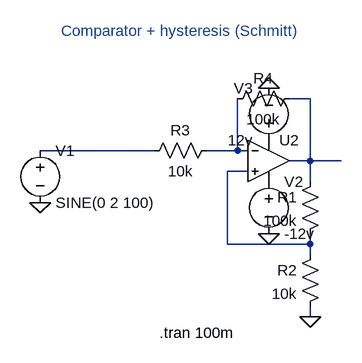
[diagram p0: schematic Comparator + hysteresis (Schmitt).asc]
Comparator + hysteresis (Schmitt).asc, the LTspice schematic file:
Version 4.1
SHEET 1 880 680
WIRE 272 48 240 48
WIRE 32 128 -144 128
WIRE 160 128 160 48
WIRE 160 128 112 128
WIRE 176 128 160 128
WIRE 272 144 272 48
WIRE 272 144 240 144
WIRE 320 144 272 144
WIRE 176 160 144 160
WIRE 272 176 272 144
WIRE 144 272 144 160
WIRE 272 272 272 256
WIRE 272 272 144 272
WIRE 272 288 272 272
WIRE 272 384 272 368
FLAG -144 208 0
FLAG 272 384 0
FLAG 208 32 0
FLAG 208 256 0
SYMBOL res 288 160 M0
SYMATTR InstName R1
SYMATTR Value 100k
SYMBOL res 288 272 M0
SYMATTR InstName R2
SYMATTR Value 10k
SYMBOL voltage -144 112 R0
WINDOW 123 0 0 Left 0
WINDOW 39 0 0 Left 0
SYMATTR InstName V1
SYMATTR Value SINE(0 2 100)
SYMBOL OpAmps\\UniversalOpAmp2 208 144 R0
SYMATTR InstName U2
SYMBOL res 128 112 R90
WINDOW 0 0 56 VBottom 2
WINDOW 3 32 56 VTop 2
SYMATTR InstName R3
SYMATTR Value 10k
SYMBOL res 256 32 R90
WINDOW 0 0 56 VBottom 2
WINDOW 3 32 56 VTop 2
SYMATTR InstName R4
SYMATTR Value 100k
SYMBOL voltage 208 160 R0
SYMATTR InstName V2
SYMATTR Value -12v
SYMBOL voltage 208 128 R180
WINDOW 0 24 96 Left 2
WINDOW 3 24 16 Left 2
SYMATTR InstName V3
SYMATTR Value 12v
TEXT 40 408 Left 2 !.tran 100m
TEXT -112 -56 Left 2 ;Comparator + hysteresis (Schmitt)

The netlist it stands for:
* Comparator + hysteresis (Schmitt).asc
R1 N001 N004 100k
R2 N004 0 10k
V1 N002 0 SINE(0 2 100)
X§U2 N004 N003 P001 P002 N001 level2 Avol=1Meg GBW=10Meg Slew=10Meg Ilimit=25m Rail=0 Vos=0 En=0 Enk=0 In=0 Ink=0 Rin=500Meg  ; pins In+ In- V+ V- OUT
R3 N003 N002 10k
R4 N001 N003 100k
V2 P002 0 -12v
V3 P001 0 12v
.tran 100m
* Comparator + hysteresis (Schmitt)
.lib UniversalOpAmp2.lib
.backanno
.end